# Altium schematic sheet pixracer_power.SchDoc
size A4; SheetNumber: 5; SheetTotal: 5
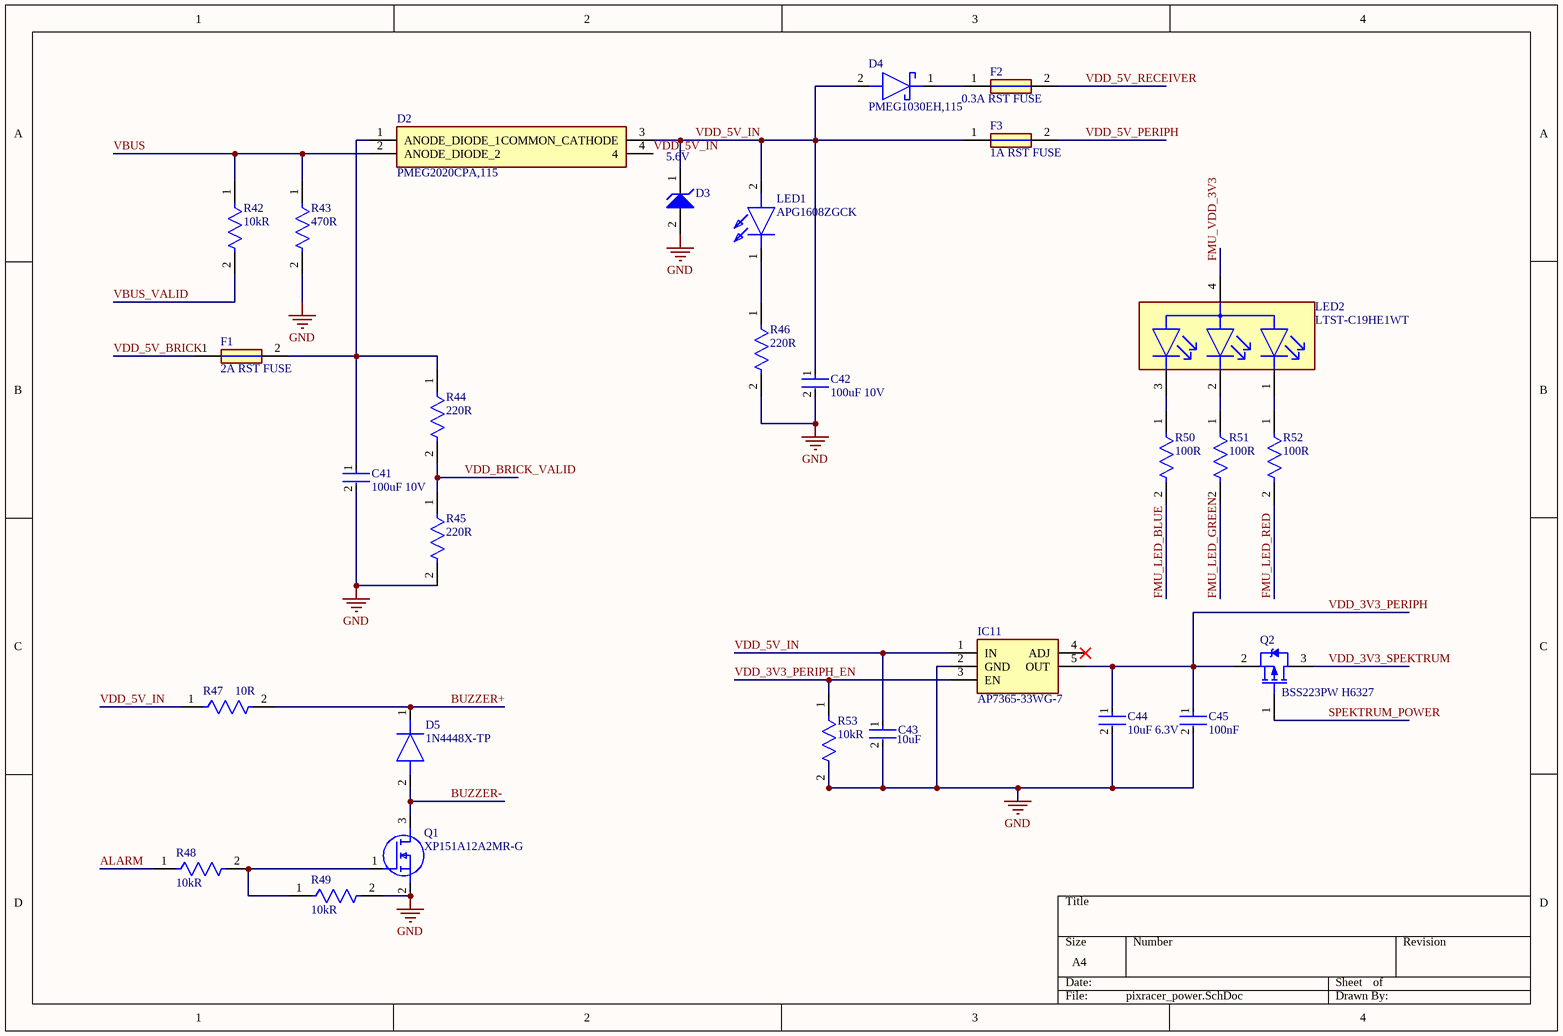
[diagram p0: pixracer_power.SchDoc]

## Parts
C41  Capacitance: 100uF 10V  [FP-C3216-160-0_3-IPC_C]  (hidden comment: C3216X5R1A107M160AC)
C42  Capacitance: 100uF 10V  [FP-C3216-160-0_3-IPC_C]  (hidden comment: C3216X5R1A107M160AC)
C43  Capacitance: 10uF  [FP-CL10-IPC_B]  (hidden comment: CL10A106KP8NNND)
C44  Capacitance: 10uF 6.3V  [FP-CC0603-0_15-0_95-IPC_B]  (hidden comment: CC0603KRX5R5BB106)
C45  Capacitance: 100nF  [FP-0603-L_1_6_0_15-W_0_81-IPC_B]  (hidden comment: 0603ZC104MAT2A)
D2  PMEG2020CPA,115  [PMEG2020CPA115]
D3  VZ Typ (V): 5.6V  [ONSC-SOD-123-2-425-04_V]  (hidden comment: MMSZ5232BT1G)
D4  PMEG1030EH,115  [SODFL3516X120N]
D5  1N4448X-TP  [1N4448XTP]
F1  value 2A RST FUSE  [FUSC3216X100N]  (hidden comment: 0ZCJ0100FF2E)
F2  value 0.3A RST FUSE  [FUSC2214X75N]  (hidden comment: 0ZCK0035FF2G)
F3  value 1A RST FUSE  [FUSC3216X100N]  (hidden comment: 0ZCJ0100FF2E)
IC11  AP7365-33WG-7  [SOT95P285X130-5N]
LED1  APG1608ZGCK  [LEDC1608X28N]
LED2  LTST-C19HE1WT  [FP-LTST-C19HE1WT-MFG]
Q1  XP151A12A2MR-G  [SOT95P280X130-3N]
Q2  BSS223PW H6327  [INF-PG-SOT-323_N]
R42  Resistance: 10kR  [FP-ERJ3G-IPC_C]  (hidden comment: ERJ-3GEYJ103V)
R43  Resistance: 470R  [FP-CRCW0603-e3-IPC_A]  (hidden comment: CRCW0603470RJNEA)
R44  Resistance: 220R  [FP-CRCW0603-e3-MFG]  (hidden comment: CRCW0603220RFKEB)
R45  Resistance: 220R  [FP-CRCW0603-e3-MFG]  (hidden comment: CRCW0603220RFKEB)
R46  Resistance: 220R  [FP-CRCW0603-e3-MFG]  (hidden comment: CRCW0603220RFKEB)
R47  value 10R  [FP-RT0603-MFG]  (hidden comment: RT0603BRD0710RL)
R48  Resistance: 10kR  [FP-ERJ3G-IPC_C]  (hidden comment: ERJ-3GEYJ103V)
R49  Resistance: 10kR  [FP-ERJ3G-IPC_C]  (hidden comment: ERJ-3GEYJ103V)
R50  Resistance: 100R  [FP-CRCW0603-e3-IPC_A]  (hidden comment: CRCW0603100RFKEB)
R51  Resistance: 100R  [FP-CRCW0603-e3-IPC_A]  (hidden comment: CRCW0603100RFKEB)
R52  Resistance: 100R  [FP-CRCW0603-e3-IPC_A]  (hidden comment: CRCW0603100RFKEB)
R53  Resistance: 10kR  [FP-ERJ3G-IPC_C]  (hidden comment: ERJ-3GEYJ103V)

## Nets
GND: C41.2 C42.2 C43.2 C44.2 C45.2 D3.2(A) IC11.2(GND) Q1.2(S) R43.2 R45.2 R46.2 R49.2 R53.2
ALARM: R48.1
BUZZER+: D5.1(K) R47.2
BUZZER-: D5.2(A) Q1.3(D)
FMU_LED_BLUE: R50.2
FMU_LED_GREEN: R51.2
FMU_LED_RED: R52.2
FMU_VDD_3V3: LED2.4(A)
SPEKTRUM_POWER: Q2.1(GATE)
VBUS: D2.2(ANODE_DIODE_2) R42.1 R43.1
VBUS_VALID: R42.2
VDD_3V3_PERIPH: C44.1 C45.1 IC11.5(OUT) Q2.2(SOURCE)
VDD_3V3_PERIPH_EN: IC11.3(EN) R53.1
VDD_3V3_SPEKTRUM: Q2.3(DRAIN)
VDD_5V_BRICK: F1.1
VDD_5V_IN: C42.1 C43.1 D2.3(COMMON_CATHODE) D2.4 D3.1(K) D4.2(A) F3.1 IC11.1(IN) LED1.2(A) R47.1
VDD_5V_PERIPH: F3.2
VDD_5V_RECEIVER: F2.2
VDD_BRICK_VALID: R44.2 R45.1
NetC41_1: C41.1 D2.1(ANODE_DIODE_1) F1.2 R44.1
NetD4_1: D4.1(K) F2.1
NetLED1_1: LED1.1(K) R46.1
NetLED2_1: LED2.1(RED_C) R52.1
NetLED2_2: LED2.2(GREEN_C) R51.1
NetLED2_3: LED2.3(BLUE_C) R50.1
NetQ1_1: Q1.1(G) R48.2 R49.1

Not connected (* = marked no-connect by the designer): IC11 4(ADJ)*

## Library data of the parts
C41 C42 = CMP-2000-05396-3: Multilayer Ceramic Capacitors 100uF ±20% 10V X5R SMD 1206; Voltage Rating (DC): 10V; Length: 3.2mm; Mount: Surface Mount; Depth: 1.6mm; Width: 1.6mm; Package Quantity: 1; Min Operating Temperature: -55°C; Packaging: Tape and Reel; Max Operating Temperature: 85°C; Dielectric: X5R; Construction: Flat; Case Code (Imperial): 1206; Thickness: 0.075inch; Radiation Hardening: No; RoHS Compliant: Yes; Series: C; Dielectric Material: Ceramic; Voltage: 10V; REACH SVHC: No SVHC; Case Code (Metric): 3216; Weight: 0.000571oz; Height: 1.6mm; Voltage Rating: 10V; Termination: SMD/SMT; Lead Free: Lead Free; Tolerance: 20%; Case/Package: 1206; Resistor Type: Ceramic
C43 = CMP-13271-003245-1: Cap Ceramic 10uF 10V X5R ±10% Pad SMD 0603 +85°C T/R; Packaging: Tape and Reel; Dielectric: X5R; Min Operating Temperature: -55°C; Lead Free: Lead Free; Height: 0.8mm; Package Quantity: 10000; Voltage Rating (DC): 10V; Mount: Surface Mount; Tolerance: 10%; Width: 0.031inch; Thickness: 0.035inch; Depth: 0.8mm; Max Operating Temperature: 85°C; Case/Package: 0603; Length: 1.6mm; Voltage Rating: 10V; Radiation Hardening: No
C44 = CMP-03422-001506-1: CAP CER 10UF 6.3V X5R 0603; Tolerance: 20%; Voltage: 4V; Depth: 0.8mm; Halogen Free: Halogen Free; Case Code (Metric): 1608; Height: 0.8mm; Voltage Rating (DC): 6.3V; Construction: Flat; Series: CC; Lead Free: Lead Free; Min Operating Temperature: -55°C; Thickness: 0.035inch; Max Operating Temperature: 85°C; Termination: SMD/SMT; Length: 1.6mm; Resistor Type: Ceramic; Dielectric: X5R; Mount: Surface Mount; Width: 0.031inch; Case/Package: 0603; Packaging: Tape and Reel; Case Code (Imperial): 0603; Voltage Rating: 6.3V; Weight: 7.1E-05oz; Radiation Hardening: No; RoHS Compliant: Yes
C45 = CMP-2006-04550-2: General Purpose Ceramic Capacitor, 0603, 100nF, 20%, X7R, 15%, 10V; Mount: Surface Mount; Package Quantity: 4000; RoHS Compliant: Yes; Case Code (Imperial): 0603; Voltage Rating: 10V; Packaging: Tape and Reel; Series: -; Tolerance: 20%; Thickness: 0.035inch; Number of Pins: 2; Min Operating Temperature: -55°C; Case/Package: 0603; Length: 1.6mm; Radiation Hardening: No; Voltage Rating (DC): 10V; Depth: 0.81mm; Lead Pitch: 0.014inch; Termination: SMD/SMT; Case Code (Metric): 1608; Construction: Flat; Width: 0.032inch; Lead Free: Lead Free; Max Operating Temperature: 125°C; Dielectric: X7R
D2 = PMEG2020CPA,115: Schottky Diode; Manufacturer_Name: Nexperia; Datasheet Link: https://assets.nexperia.com/documents/data-sheet/PMEG2020CPA.pdf; Height: 0.65mm; Manufacturer_Part_Number: PMEG2020CPA,115; Mouser Part Number: 771-PMEG2020CPA115; Mouser Price/Stock: https://www.mouser.co.uk/ProductDetail/Nexperia/PMEG2020CPA115?qs=O%2F7ihdSJpebmoeJaQpZU%2FA%3D%3D; Arrow Part Number: PMEG2020CPA,115; Arrow Price/Stock: https://www.arrow.com/en/products/pmeg2020cpa115/nexperia
D3 = CMP-1060-00586-1: Zener Voltage Regulator, 500 mW, 2-Pin SOD-123, Pb-Free, Tape and Reel; Manufacturer: On Semiconductor; P Max (W): 0.5; ComponentLink3URL: http://www.onsemi.com/pub_link/Collateral/425-04.PDF; Packing: Tape and Reel; ComponentLink3Description: Package Specification; ComponentLink2URL: http://www.onsemi.com/pub_link/Collateral/MMSZ5221BT1-D.PDF; ComponentLink1URL: http://www.onsemi.com/; ComponentLink2Description: Datasheet; PackageReference: SOD-123-2-425-04; ComponentLink1Description: Manufacturer URL; PartNumber: MMSZ5232BT1G; PackageVersion: Rev. G, 10/2009; PackageDescription: 2-Pin SOD, Body 1.6 x 2.69 mm; Mounting Technology: Surface Mount; RoHS: Pb-Free; DatasheetVersion: Rev. 12
D4 = PMEG1030EH,115: Schottky Diode; Manufacturer_Name: NXP; Datasheet Link: https://assets.nexperia.com/documents/data-sheet/PMEG1030EH_EJ.pdf; Height: 1.2mm; Manufacturer_Part_Number: PMEG1030EH,115
D5 = 1N4448X-TP: Diode; Manufacturer_Name: Micro Commercial Components (MCC); Datasheet Link: https://www.mccsemi.com/pdf/Products/1N4448X(SOD-523).PDF; Height: 0.65mm; Manufacturer_Part_Number: 1N4448X-TP; Mouser Part Number: 833-1N4448X-TP; Mouser Price/Stock: https://www.mouser.co.uk/ProductDetail/Micro-Commercial-Components-MCC/1N4448X-TP?qs=0RDYWt4CO4fFI8HfN%2F4aEA%3D%3D; Arrow Part Number: 1N4448X-TP; Arrow Price/Stock: https://www.arrow.com/en/products/1n4448x-tp/micro-commercial-components?region=europe
F1 F3 = 0ZCJ0100FF2E: Fuse; Manufacturer_Name: Bel; Datasheet Link: https://eu.mouser.com/datasheet/2/643/0ZCJ_Nov2016-1132002.pdf; Height: 1mm; Manufacturer_Part_Number: 0ZCJ0100FF2E; Mouser Part Number: 530-0ZCJ0100FF2E
F2 = 0ZCK0035FF2G: Fuse; Manufacturer_Name: Bel; Datasheet Link: https://www.mouser.se/datasheet/2/643/0ZCK_Nov2016-1135081.pdf; Height: 0.75mm; Manufacturer_Part_Number: 0ZCK0035FF2G; Mouser Part Number: 530-0ZCK0035FF2G
IC11 = AP7365-33WG-7: Integrated Circuit; Manufacturer_Name: Diodes Inc.; Datasheet Link: https://componentsearchengine.com/Datasheets/1/AP7365-33WG-7.pdf; Height: 1.3mm; Manufacturer_Part_Number: AP7365-33WG-7; Mouser Part Number: 621-AP7365-33WG-7; Mouser Price/Stock: https://www.mouser.co.uk/ProductDetail/Diodes-Incorporated/AP7365-33WG-7?qs=abZ1nkZpTuOZFvxvoFPL0w%3D%3D; Arrow Part Number: AP7365-33WG-7; Arrow Price/Stock: https://www.arrow.com/en/products/ap7365-33wg-7/diodes-incorporated?region=nac
LED1 = APG1608ZGCK: LED; Manufacturer_Name: Kingbright; Datasheet Link: http://www.kingbrightusa.com/images/catalog/SPEC/APG1608ZGCK.pdf; Height: 0.28mm; Manufacturer_Part_Number: APG1608ZGCK; Mouser Part Number: 604-APG1608ZGCK; Mouser Price/Stock: https://www.mouser.co.uk/ProductDetail/Kingbright/APG1608ZGCK?qs=Oo40KB9lBTmmOma0ledTcg%3D%3D; Arrow Part Number: APG1608ZGCK; Arrow Price/Stock: https://www.arrow.com/en/products/apg1608zgck/kingbright
LED2 = CMP-2000-05201-2: LED RGB DIFFUSED CHIP SMD; Number of LEDs: 3; Test Current: 20mA; Luminous Intensity: 180mcd; Lens Color: White; Dominant Wavelength: 470nm; Color: Blue; Reverse Voltage: 5V; Viewing Angle: 130°; Forward Voltage: 3.35V; Max Operating Temperature: 80°C; Packaging: Tape and Reel; Lens Transparency: Diffused; Width: 1.6mm; Case Code (Metric): 1616; Height: 0.35mm; Lens Style: Diffused; Mount: Surface Mount; Package Quantity: 3000; Radiation Hardening: No; Length: 1.6mm; Case/Package: 0606; Forward Current: 20mA; Case Code (Imperial): 0606; Lead Free: Lead Free; Min Operating Temperature: -20°C; Number of Elements: 3; Number of Pins: 4; Depth: 1.6mm
Q1 = XP151A12A2MR-G: MOSFET (N-Channel); Manufacturer_Name: Torex; Datasheet Link: https://www.torexsemi.com/file/xp151a12a2mr/XP151A12A2MR.pdf; Height: 1.3mm; Manufacturer_Part_Number: XP151A12A2MR-G; Mouser Part Number: 865-XP151A12A2MR-G; Mouser Price/Stock: https://www.mouser.co.uk/ProductDetail/Torex-Semiconductor/XP151A12A2MR-G?qs=AsjdqWjXhJ%252BYt8dSaKx3TA%3D%3D
Q2 = CMP-1099-00033-1: P-Channel OptiMOS P Small-Signal-Transistor, -20 V VDS, -0.39 A ID, -55 to 150 degC, PG-SOT-323, Reel, Green; Manufacturer: Infineon; RDS (on) (max) (@4.5V): 1,200Â mOhm; Pto t (max): 0.25Â W; VGS(th) (min): -0.6Â V; ID (max): -0.39Â A; VGS(th) (max): -1.2Â V; RDS (on) (max): 2,100Â mOhm; IDpuls (max): -1.56Â A; QG: -0.5Â nC; VDS (max): -20Â V; Rth: 500Â K/W; Green: TRUE; Mounting Technology: Surface Mount; PackageReference: PG-SOT-323; ComponentLink3Description: Package Specification; ComponentLink3URL: http://www.infineon.com/dgdl/SOT323-Package_Overview.pdf?folderId=db3a30431936bc4b0119533e1dcb3c92&fileId=db3a30431936bc4b011953495f283cb1; DatasheetVersion: Rev. 1.5; PackageDescription: 3-Pin Small Outline Transistor Package, 2 x 1.25 mm Body, 0.65 mm Pitch; ComponentLink1Description: Manufacturer URL; ComponentLink2URL: http://www.infineon.com/dgdl/BSS223PW_Rev1.5.pdf?folderId=db3a304314dca38901154a72e3951a65&fileId=db3a3043321e49940132481523b6245f; Halogen-free: TRUE; ComponentLink1URL: http://www.infineon.com/; ComponentLink2Description: Datasheet; Packing: Reel; PartNumber: BSS223PW H6327; RDS (on) (max) (@2.5V): 2,100Â mOhm; PackageVersion: Apr-08
R42 R48 R49 R53 = CMP-2000-00704-2: RES SMD 10K OHM 5% 1/10W 0603; Temperature Coefficient: 200ppm/°C; Max Power Dissipation: 100mW; Voltage Rating (DC): 50V; Voltage Rating: 75V; Resistor Type: Thick Film; Tolerance: 5%; Military Standard: Not; Package Quantity: 1; Max Operating Temperature: 155°C; Mount: Surface Mount; Technology: THICK FILM; Case/Package: 0603; Construction: Rectangular; Depth: 0.8mm; Case Code (Imperial): 0603; Weight: 7.1E-05oz; Features: Automotive AEC-Q200; Packaging: Tape and Reel; Width: 0.8mm; Length: 1.6mm; Termination: SMD/SMT; Power Rating: 100mW; Lead Free: Lead Free; Number of Terminations: 2; Height: 0.45mm; RoHS Compliant: Yes; Min Operating Temperature: -55°C; Contact Plating: Tin; REACH SVHC: No SVHC; Resistance Tolerance: 5%; Series: ERJ; Working Voltage: 75V; Case Code (Metric): 1608
R43 = CMP-2000-03374-2: RES Thick Film, 470Ω, 5%, 0.1W, 200ppm/°C, 0603; Power Rating: 100mW; Voltage Rating: 75V; Case Code (Metric): 1608; Number of Terminations: 2; Min Operating Temperature: -55°C; Features: Automotive AEC-Q200; Military Standard: Not; Composition: Thick Film; Contact Plating: Tin; Case Code (Imperial): 0603; Package Quantity: 1; Mount: Surface Mount; Radiation Hardening: No; Depth: 0.85mm; Packaging: Tape and Reel; Length: 1.55mm; Termination: SMD/SMT; Weight: 7.1E-05oz; Max Operating Temperature: 155°C; Width: 0.033inch; Tolerance: 5%; Max Power Dissipation: 100mW; Height: 0.45mm; Case/Package: 0603; Temperature Coefficient: 200ppm/°C; Working Voltage: 75V
R44-R46 = CMP-02407-003555-1: RES Thick Film, 220Ω, 1%, 0.1W, 100ppm/°C, 0603; Voltage Rating: 75V; Power Rating: 100mW; Length: 1.55mm; Weight: 7.1E-05oz; Package Quantity: 10000; Case/Package: 0603; Composition: Thick Film; Max Operating Temperature: 155°C; Military Standard: Not; Tolerance: 1%; Lead Free: Lead Free; Number of Terminations: 2; Min Operating Temperature: -55°C; Case Code (Imperial): 0603; Max Power Dissipation: 100mW; Features: Automotive AEC-Q200; Packaging: Tape and Reel; Temperature Coefficient: 100ppm/°C; Case Code (Metric): 1608; Termination: SMD/SMT; Depth: 0.85mm; Height: 0.02inch; Width: 0.85mm
R47 = CMP-2000-04347-2: RES SMD 10 OHM 0.1% 1/10W 0603; Manufacturer: Yageo; Resistance: 10Ω; Temperature Coefficient: 25 ppm/°C; Power Rating: 0.1W; Tolerance: 0.001; Voltage Rating: 75V; Height: 0.55mm; Temperature Range Low: -55°C; Temperature Range High: +155°C; Package: RT0603; Digikey Description: RES SMD 10 OHM 0.1% 1/10W 0603; Lead Free: Yes; Ipc Land Pattern Name: RESC16080X45; Mouser Description: Thin Film Resistors - SMD 1/10W 10 ohm .1% 25ppm; Automotive: No; Footprint Url: http://www.yageo.com/exep/pages/download/literatures/PYu-R_Mount_10.pdf; Series: RT; Device Class L3: Chip SMD Resistors; Device Class L2: Resistors; Octopart: https://octopart.com/rt0603brd0710rl-yageo-1216748; Temperature: -55°C to +155°C; Manufacturer Part Number: RT0603BRD0710RL; Composition: Thin Film; Category: Res; ComponentLink2Description: Datasheet; Device Class L1: Passive Components; RoHS: TRUE; ComponentLink2URL: http://www.yageo.com/documents/recent/PYu-RT_1-to-0.01_RoHS_L_9.pdf
R50-R52 = CMP-2000-03825-2: RES Thick Film, 100Ω, 1%, 0.1W, 100ppm/°C, 0603; Voltage Rating (DC): 75V; Power Rating: 100mW; Case Code (Imperial): 0603; Case/Package: 0603; Composition: Thick Film; Military Standard: Not; Number of Terminations: 2; Packaging: Tape and Reel; Depth: 0.85mm; Height: 0.02inch; Features: Automotive AEC-Q200; Width: 0.033inch; Lead Free: Lead Free; Contact Plating: Tin; Package Quantity: 10000; Length: 1.55mm; Tolerance: 1%; Temperature Coefficient: 100ppm/°C; Max Operating Temperature: 155°C; Weight: 7.1E-05oz; Voltage Rating: 75V; Radiation Hardening: No; Max Power Dissipation: 100mW; Termination: SMD/SMT; Min Operating Temperature: -55°C; Case Code (Metric): 1608